# EAGLE design SimpleCircuit (EAGLE 9.2.2)
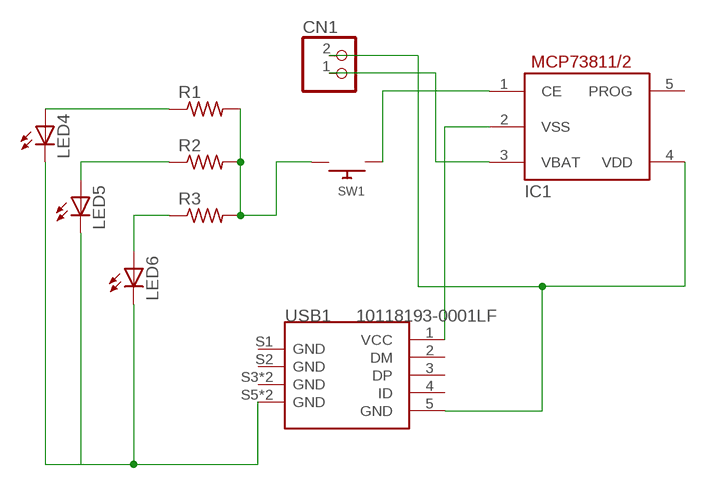
[diagram p0: schematic, sheet 1]

## Parts
CN1  JST_2PIN-SMT  [JST-PH-2-SMT]
IC1  MCP73811/2  [SOT23-5L]
LED4  LEDMICRO-SIDELED  [MICRO-SIDELED]
LED5  LEDMICRO-SIDELED  [MICRO-SIDELED]
LED6  LEDMICRO-SIDELED  [MICRO-SIDELED]
R1  R-US_R0805W  [R0805W]
R2  R-US_R0805W  [R0805W]
R3  R-US_R0805W  [R0805W]
SW1  SWITCH_PUSHBUTTONC&K_KSS  [BTN_CK_KSS]
USB1  10118193-0001LF  MICRO-USB-SMD-B-(10118193-0001LF)  [MICRO-USB5+6P-SMD-0.65-B]

## Nets
N$1: R1.2 R2.2 R3.2 SW1.P$2
N$2: LED4.A R1.1
N$3: LED5.A R2.1
N$4: LED6.A R3.1
N$5: IC1.2(VSS) USB1.1(VCC)
N$7: CN1.2 IC1.4(VDD) USB1.5(GND)
N$8: LED4.C LED5.C LED6.C USB1.S5(GND) USB1.S6(GND)
N$9: IC1.1(CE) SW1.P$1
N$10: CN1.1 IC1.3(VBAT)
Unconnected: IC1.5(PROG) USB1.2(DM) USB1.3(DP) USB1.4(ID) USB1.S1(GND) USB1.S2(GND) USB1.S3(GND) USB1.S4(GND)

## Library data of the parts
CN1 = adafruit:JST_2PIN: JST 2-Pin Connectors of various flavors SMT-RA (S2B-PH-SM4) 4UConnector #17311 SMT (B2B-PH-SM4) THM-RA (S2B-PH) THM (B2B-PH)
IC1 = adafruit:MCP73811/2: MCP73811 and MCP73812 Simple, Miniature Single-Cell, Fully Integrated Li-Ion / Li-Polymer Charge Management Controllers SOT-23-5 package, no indicator LED but with adjustable current, small and very inexpensive
LED4-LED6 = led:LED: LED OSRAM: - CHIPLED LG R971, LG N971, LY N971, LG Q971, LY Q971, LO R971, LY R971 LH N974, LH R974 LS Q976, LO Q976, LY Q976 LO Q996 - Hyper CHIPLED LW Q18S LB Q993, LB Q99A, LB R99A - SideLED LS A670, LO A670, LY A670, LG A670, LP A670 LB A673, LV A673, LT A673, LW A673 LH A674 LY A675 LS A676, LA A676, LO A676, LY A676, LW A676 LS A679, LY A679, LG A679 - Hyper Micro SIDELED® LS Y876, LA Y876, LO Y876, LY Y876 LT Y87S - SmartLED LW L88C, LW L88S LB L89C, LB L89S, LG L890 LS L89K, LO L89K, LY L89K LS L896, LA L896, LO L896, LY L896 - TOPLED LS T670, LO T670, LY T670, LG T670, LP T670 LSG T670, LSP T670, LSY T670, LOP T670, LYG T670 LG T671, LOG T671, LSG T671 LB T673, LV T673, LT T673, LW T673 LH T674 LS T676, LA T676, LO T676, LY T676, LB T676, LH T676, LSB T676, LW T676 LB T67C, LV T67C, LT T67C, LS T67K, LO T67K, LY T67K, LW E67C LS E67B, LA E67B, LO E67B, LY E67B, LB E67C, LV E67C, LT E67C LW T67C LS T679, LY T679, LG T679 LS T770, LO T770, LY T770, LG T770, LP T770 LB T773, LV T773, LT T773, LW T773 LH T774 LS E675, LA E675, LY E675, LS T675 LS T776, LA T776, LO T776, LY T776, LB T776 LHGB T686 LT T68C, LB T68C - Hyper Mini TOPLED® LB M676 - Mini TOPLED Santana® LG M470 LS M47K, LO M47K, LY M47K Source: http://www.osram.convergy.de LUXEON: - LUMILED® LXK2-PW12-R00, LXK2-PW12-S00, LXK2-PW14-U00, LXK2-PW14-V00 LXK2-PM12-R00, LXK2-PM12-S00, LXK2-PM14-U00 LXK2-PE12-Q00, LXK2-PE12-R00, LXK2-PE12-S00, LXK2-PE14-T00, LXK2-PE14-U00 LXK2-PB12-K00, LXK2-PB12-L00, LXK2-PB12-M00, LXK2-PB14-N00, LXK2-PB14-P00, LXK2-PB14-Q00 LXK2-PR12-L00, LXK2-PR12-M00, LXK2-PR14-Q00, LXK2-PR14-R00 LXK2-PD12-Q00, LXK2-PD12-R00, LXK2-PD12-S00 LXK2-PH12-R00, LXK2-PH12-S00 LXK2-PL12-P00, LXK2-PL12-Q00, LXK2-PL12-R00 Source: www.luxeon.com KINGBRIGHT: KA-3528ASYC Source: www.kingbright.com
R1-R3 = adafruit:R-US_: RESISTOR, American symbol
SW1 = adafruit:SWITCH_PUSHBUTTON: Buttons SOFTTOUCHSMD_SJ - Soft touch temporary push button (Super Junk Akihabara) Compatible with SKPMANE010 [Mouser: 688-SKPMAN] C&K_KSS = Digikey: KSS221GLFS
USB1 = Seeed-Connector:MICRO-USB-SMD-B-(10118193-0001LF): 320010003; MPN: 10118193-0001LF

## Net classes
0 default: width 0.152 mm

## Board
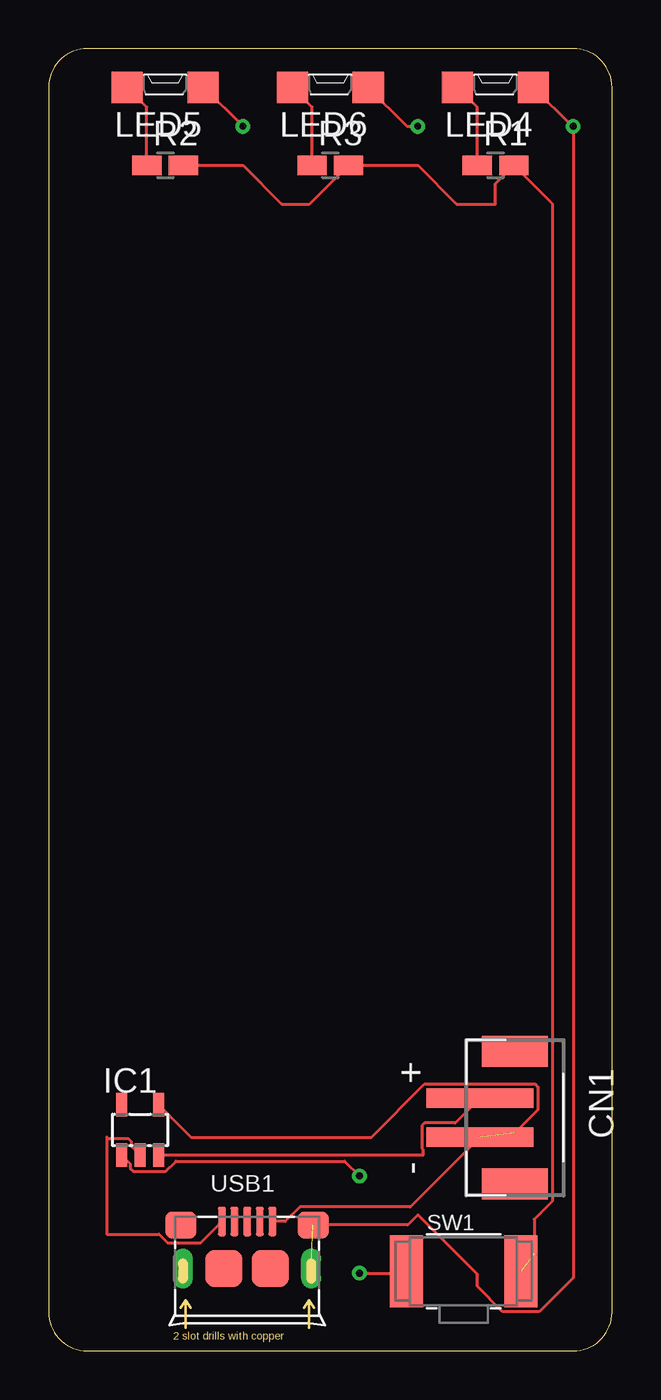
[diagram p1: board, top side]
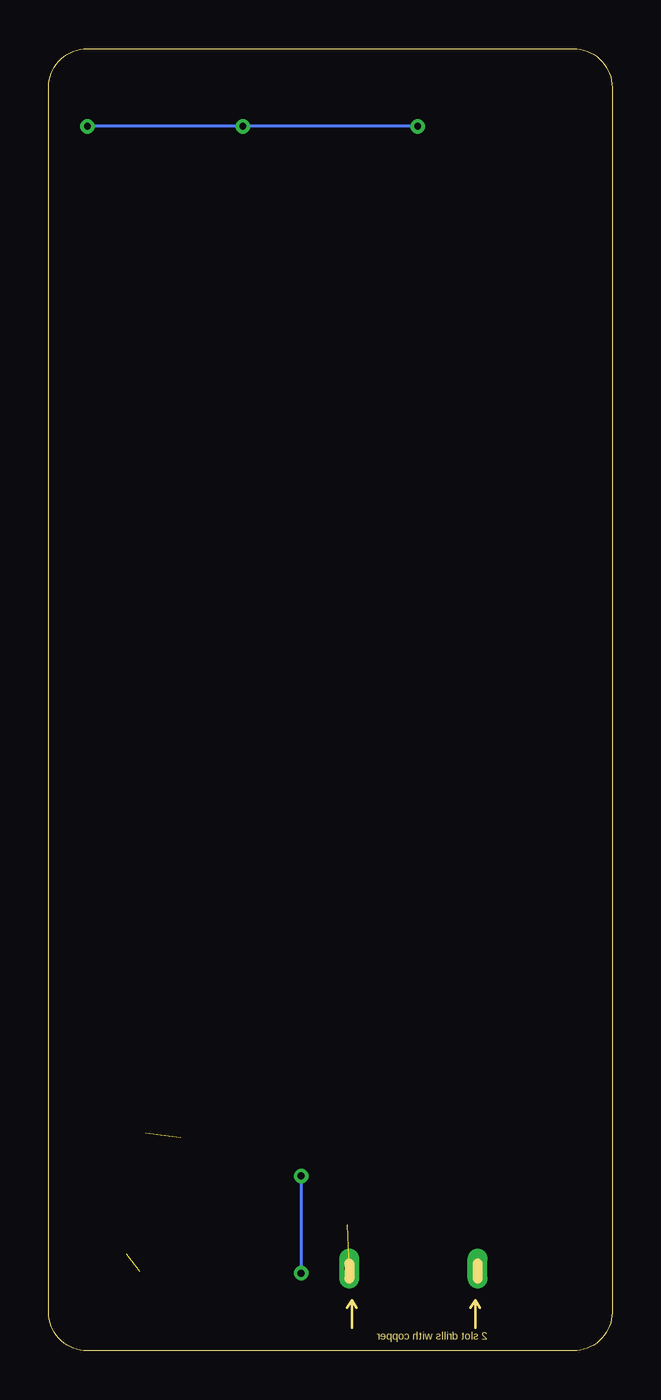
[diagram p2: board, bottom side, seen from below]

Size 29 x 67 mm. Coordinates in mm from the lower left corner, seen from the top.
Outline: 0,65 0,2 arc90 2,0 27,0 arc90 29,2 29,65 arc90 27,67 2,67 arc90 0,65
Copper layers (1*16): Top 0.035mm / dielectric 1.5mm / Bottom 0.035mm
Design rules "default *": minimum track width 6mil, minimum drill 0.35mm, track to track 6mil, track to pad 6mil, pad to pad 6mil, via to via 6mil, smd to smd 6mil, copper to edge 40mil, drill to drill 6mil, minimum pad ring 10mil, minimum via ring 8mil, stop-mask expansion 4mil, vias tented up to drill 0mil, thermal gap 10mil

### Footprints (pad centres in the part's own frame; a part is rotated, then mirrored left to right if it is on the bottom)
JST-PH-2-SMT = smd 1 x 5.5: 1 -1,-1.8; 2 1,-1.8 | smd 1.6 x 3.4: NC1 -3.4,0; NC2 3.4,0
SOT23-5L = smd 0.55 x 1.2: 1 -0.95,-1.3; 2 0,-1.3; 3 0.95,-1.3; 4 0.95,1.3; 5 -0.95,1.3
MICRO-SIDELED = smd 1.6 x 1.6: A 0,1.95; C 0,-1.95
R0805W = smd 1.5 x 1: 1 -0.94,0; 2 0.94,0
BTN_CK_KSS = smd 1.7 x 3.7: P$1 -2.95,0; P$2 2.95,0
MICRO-USB5+6P-SMD-0.65-B = smd 0.4 x 1.5: 1 -1.3,-0.25; 2 -0.65,-0.25; 3 0,-0.25; 4 0.65,-0.25; 5 1.3,-0.25 | smd 1.6 x 1.4: S1 -3.4,-0.427; S6 3.4,-0.427 | drill 0.508 pad 1.016 long: S2 -3.3,-2.675; S5 3.3,-2.675 | smd 1.9 x 1.9: S3 -1.2,-2.675; S4 1.2,-2.675

### Placement (x,y rotation side)
CN1  24,12 270 top
IC1  4.71,11.37 0 top
LED4  23,65 90 top
LED5  6,65 90 top
LED6  14.5,65 90 top
R1  23,61 0 top
R2  6,61 0 top
R3  14.5,61 0 top
SW1  21.36,4.1 0 top
USB1  10.22,6.91 0 top

### Tracks (layer width: path | path; a pad name or v marks a point on that pad's centre or on a via)
N$1  (1 unrouted)
  Top 0.152: R2.2 10,61 12,59 13.44,59 R3.2 19,61 21,59 23,59 23,60.06 R1.2 25.93,59.01 25.93,7.71 25,6.78 25,5
N$2
  Top 0.152: R1.1 22.06,63.99 LED4.A
N$3
  Top 0.152: R2.1 5.06,63.99 LED5.A
N$4
  Top 0.152: R3.1 13.56,63.99 LED6.A
N$5
  Top 0.152: IC1.2 4.26,10.52 4.26,10.77 4.13,10.9 3.1,10.9 3,11 3,6 5.68,6 6.13,5.55 7.81,5.55 USB1.1
N$7  (1 unrouted)
  Top 0.152: USB1.5 12.18,6.66 12.93,7.41 18.61,7.41 CN1.2 | IC1.4 7.33,11 16.63,11 19.36,13.73 25.05,13.73 25.18,13.6 25.18,12.4 24,11.23 24,11
N$8  (via drill 0.35)  (1 unrouted)
  Top 0.152: LED5.C 8,65 v10,63 | LED6.C 18.45,63 v19,63 | LED4.C 26.95,63 v27,63 27,3.77 25.25,2.02 23.36,2.02 22.07,3.31 22.07,3.93 19,7 18.48,6.48 USB1.S6
  Bottom 0.152: v10,63 v19,63 v27,63
N$9  (via drill 0.35)
  Top 0.152: IC1.1 4.21,9.62 4.21,9.38 4.34,9.24 6.03,9.24 6.55,9.77 15.23,9.77 v16,9 | v16,4 18.31,4 SW1.P$1
  Bottom 0.152: v16,9 v16,4
N$10
  Top 0.152: IC1.3 19.27,10.07 19.27,10.36 19.22,10.4 19.22,11.6 19.36,11.73 20.93,11.73 CN1.1